# EAGLE schematic Shield_schematic (EAGLE 8.4.0)
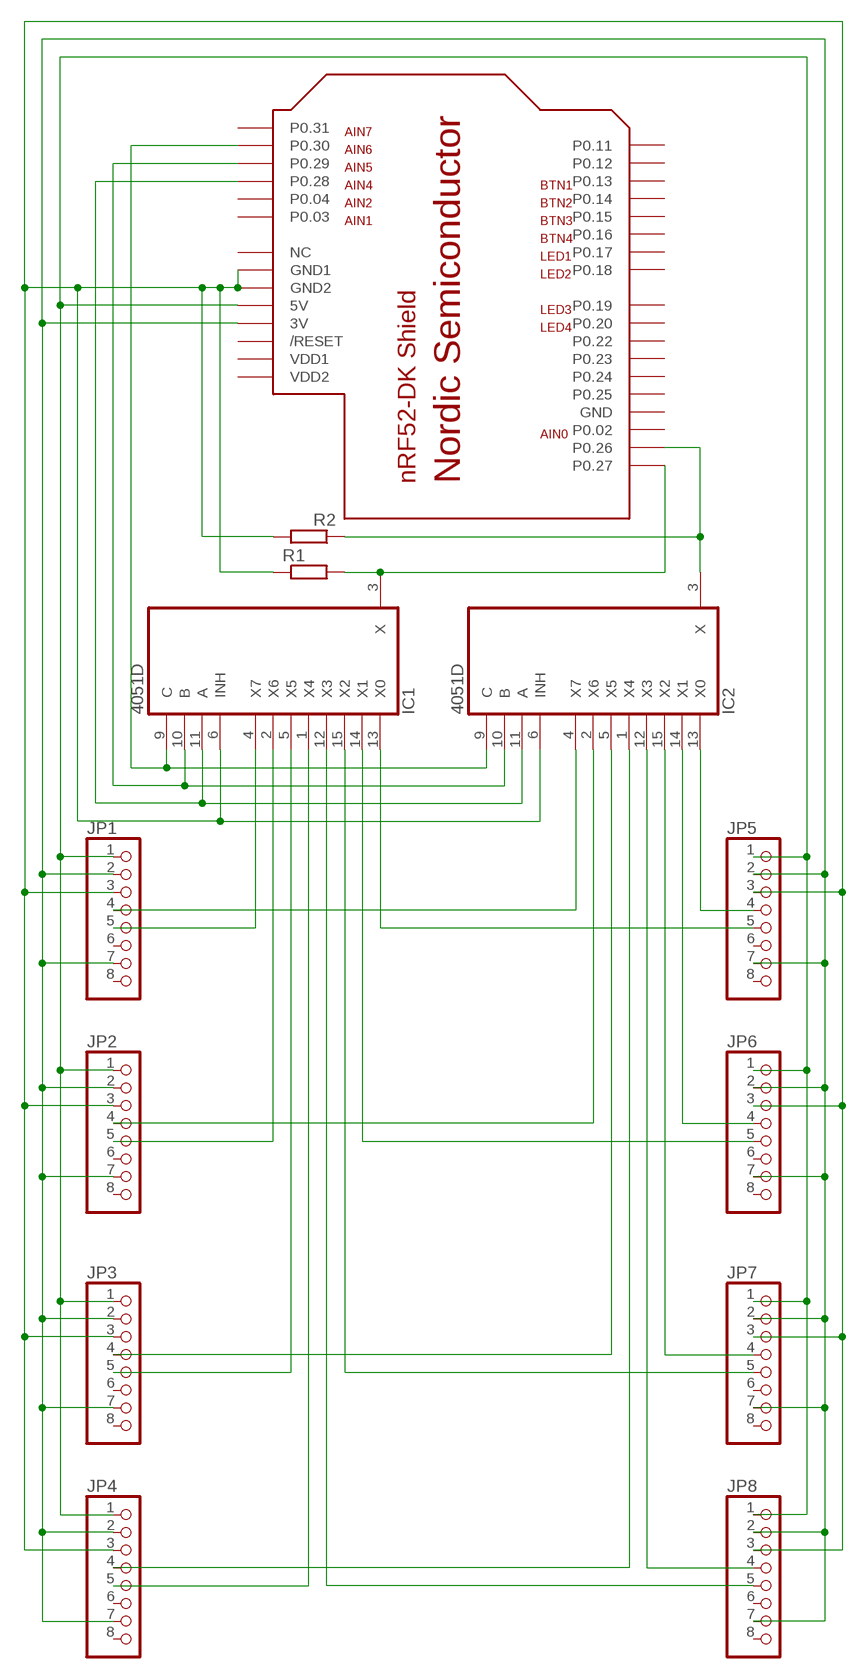
[diagram p0: schematic, sheet 1]

## Parts
IC1  4051D  [SO16]
IC2  4051D  [SO16]
JP1  PINHD-1X8  [1X08]
JP2  PINHD-1X8  [1X08]
JP3  PINHD-1X8  [1X08]
JP4  PINHD-1X8  [1X08]
JP5  PINHD-1X8  [1X08]
JP6  PINHD-1X8  [1X08]
JP7  PINHD-1X8  [1X08]
JP8  PINHD-1X8  [1X08]
R1  R-EU_0411/15  [0411/15]
R2  R-EU_0411/15  [0411/15]
U$1  NRF52-SHIELD-NOTEXT  [NRF52-SHIELD]

## Nets
N$1: JP1.1 JP2.1 JP3.1 JP4.1 JP5.1 JP6.1 JP7.1 JP8.1 U$1.5V
N$2: JP1.2 JP1.7 JP2.2 JP2.7 JP3.2 JP3.7 JP4.2 JP4.7 JP5.2 JP5.7 JP6.2 JP6.7 JP7.2 JP7.7 JP8.2 JP8.7 U$1.3V
N$3: IC2.3(X) R2.1 U$1.P26(P0.26)
N$5: IC2.13(X0) JP5.4
N$6: IC1.13(X0) JP5.5
N$7: IC1.14(X1) JP6.5
N$8: IC1.15(X2) JP7.5
N$9: IC1.12(X3) JP8.5
N$10: IC1.4(X7) JP1.5
N$11: IC1.2(X6) JP2.5
N$12: IC1.5(X5) JP3.5
N$13: IC1.1(X4) JP4.5
N$14: IC2.14(X1) JP6.4
N$16: IC2.15(X2) JP7.4
N$17: IC2.12(X3) JP8.4
N$18: IC2.1(X4) JP4.4
N$19: IC2.5(X5) JP3.4
N$20: IC2.2(X6) JP2.4
N$21: IC2.4(X7) JP1.4
N$22: IC1.11(A) IC2.11(A) U$1.P28(P0.28)
N$23: IC1.3(X) R1.2 U$1.P27(P0.27)
N$25: IC1.10(B) IC2.10(B) U$1.P29(P0.29)
N$26: IC1.6(INH) IC2.6(INH) JP1.3 JP2.3 JP3.3 JP4.3 JP5.3 JP6.3 JP7.3 JP8.3 R1.1 R2.2 U$1.GND1 U$1.GND2
N$27: IC1.9(C) IC2.9(C) U$1.P30(P0.30)
Unconnected: JP1.6 JP1.8 JP2.6 JP2.8 JP3.6 JP3.8 JP4.6 JP4.8 JP5.6 JP5.8 JP6.6 JP6.8 JP7.6 JP7.8 JP8.6 JP8.8 U$1.NC U$1.P02(P0.02) U$1.P03(P0.03) U$1.P04(P0.04) U$1.P11(P0.11) U$1.P12(P0.12) U$1.P13(P0.13) U$1.P14(P0.14) U$1.P15(P0.15) U$1.P16(P0.16) U$1.P17(P0.17) U$1.P18(P0.18) U$1.P19(P0.19) U$1.P20(P0.20) U$1.P22(P0.22) U$1.P23(P0.23) U$1.P24(P0.24) U$1.P25(P0.25) U$1.P31(P0.31) U$1.RESET(/RESET)

## Power pins joined to a net without a drawn wire
GND: IC1.8(GND) IC2.8(GND) U$1.GND
VCC: IC1.16(VCC) IC2.16(VCC)
VDD1: U$1.VDD2(VDD1)
VDD2: U$1.VDD1(VDD2)
VEE: IC1.7(VEE) IC2.7(VEE)

## Library data of the parts
IC1 IC2 = 40xx:4051: 8-channel ANALOG MULTIPLEXER
JP1-JP8 = pinhead:PINHD-1X8: PIN HEADER
R1 R2 = rcl:R-EU_: RESISTOR, European symbol
U$1 = nrf52-shield:NRF52-SHIELD: nRF5 devkit shield